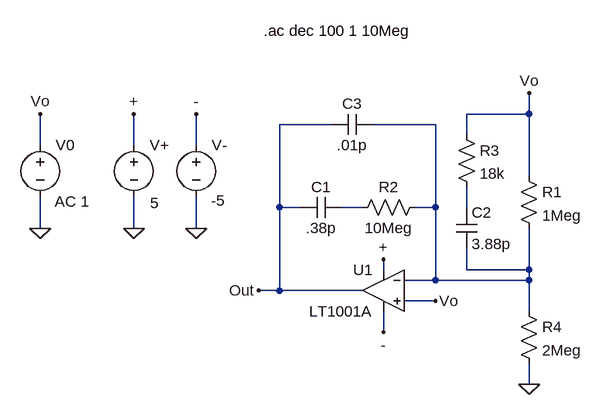
[diagram p0: schematic Draft3.asc]
Draft3.asc, the LTspice schematic file:
Version 4
SHEET 1 2176 1260
WIRE 864 -64 864 -96
WIRE 864 -64 768 -64
WIRE 560 -48 480 -48
WIRE 720 -48 624 -48
WIRE 768 -32 768 -64
WIRE 112 -16 112 -64
WIRE 256 -16 256 -64
WIRE 352 -16 352 -64
WIRE 864 32 864 -64
WIRE 480 80 480 -48
WIRE 512 80 480 80
WIRE 608 80 576 80
WIRE 720 80 720 -48
WIRE 720 80 688 80
WIRE 768 80 768 48
WIRE 112 112 112 64
WIRE 256 112 256 64
WIRE 352 112 352 64
WIRE 640 176 640 160
WIRE 768 176 768 144
WIRE 864 176 864 112
WIRE 864 176 768 176
WIRE 720 192 720 80
WIRE 720 192 672 192
WIRE 864 192 864 176
WIRE 864 192 720 192
WIRE 480 208 480 80
WIRE 480 208 448 208
WIRE 608 208 480 208
WIRE 720 224 672 224
WIRE 864 240 864 192
WIRE 640 272 640 240
WIRE 864 352 864 320
FLAG 864 352 0
FLAG 112 112 0
FLAG 112 -64 Vo
FLAG 864 -96 Vo
FLAG 448 208 Out
FLAG 256 112 0
FLAG 256 -64 +
FLAG 640 160 +
FLAG 352 112 0
FLAG 352 -64 -
FLAG 640 272 -
FLAG 720 224 Vo
SYMBOL OpAmps\\LT1001A 640 144 M0
SYMATTR InstName U1
SYMBOL res 704 64 R90
WINDOW 0 0 56 VBottom 2
WINDOW 3 32 56 VTop 2
SYMATTR InstName R2
SYMATTR Value 10Meg
SYMBOL cap 576 64 R90
WINDOW 0 0 32 VBottom 2
WINDOW 3 32 32 VTop 2
SYMATTR InstName C1
SYMATTR Value .38p
SYMBOL cap 624 -64 R90
WINDOW 0 0 32 VBottom 2
WINDOW 3 32 32 VTop 2
SYMATTR InstName C3
SYMATTR Value .01p
SYMBOL cap 752 80 R0
SYMATTR InstName C2
SYMATTR Value 3.88p
SYMBOL res 752 -48 R0
SYMATTR InstName R3
SYMATTR Value 18k
SYMBOL res 848 16 R0
SYMATTR InstName R1
SYMATTR Value 1Meg
SYMBOL res 848 224 R0
SYMATTR InstName R4
SYMATTR Value 2Meg
SYMBOL voltage 112 -32 R0
WINDOW 123 22 103 Left 2
WINDOW 39 0 0 Left 0
SYMATTR InstName V0
SYMATTR Value ""
SYMATTR Value2 AC 1
SYMBOL voltage 256 -32 R0
WINDOW 3 25 105 Left 2
SYMATTR InstName V+
SYMATTR Value 5
SYMBOL voltage 352 -32 R0
WINDOW 3 23 101 Left 2
SYMATTR InstName V-
SYMATTR Value -5
TEXT 456 -192 Left 2 !.ac dec 100 1 10Meg

The netlist it stands for:
* Draft3.asc
XU1 Vo N001 + - Out LT1001  ; LT1001A, pins In+ In- V+ V- OUT
R2 N001 N002 10Meg
C1 N002 Out .38p
C3 N001 Out .01p
C2 N003 N001 3.88p
R3 Vo N003 18k
R1 Vo N001 1Meg
R4 N001 0 2Meg
V0 Vo 0 AC 1
V+ + 0 5
V- - 0 -5
.ac dec 100 1 10Meg
.lib LTC.lib
.backanno
.end